# Altium schematic sheet MCU.SchDoc
size A4; SheetNumber: 2; SheetTotal: 5
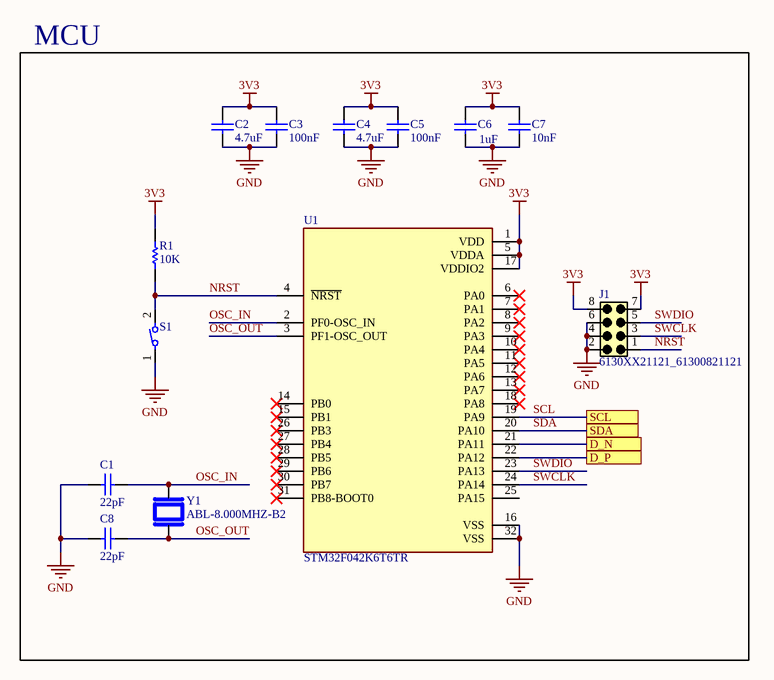
[diagram p0: MCU.SchDoc]

## Parts
C1  22pF  [CAP_0402L]
C2  4.7uF  [CAP_0402L]
C3  100nF  [CAP_0402L]
C4  4.7uF  [CAP_0402L]
C5  100nF  [CAP_0402L]
C6  1uF  [CAP_0402L]
C7  10nF  [CAP_0402L]
C8  22pF  [CAP_0402L]
J1  6130XX21121_61300821121  [61300821121]
R1  10K  [RES_0402N]
S1  434123025816  [434123025816]  (value not drawn)
U1  STM32F042K6T6TR  [QFP80P900X900X160-32N]
Y1  ABL-8.000MHZ-B2  [XTAL_HC49P488W46L1150T500H350]

## Blocks framed on the sheet
MCU: C1-C8 J1 R1 S1 U1 Y1

## Ports
D_N, D_P, SCL, SDA

## Nets
3V3: C2.2 C3.2 C4.2 C5.2 C6.2 C7.2 J1.7 J1.8 R1.2 U1.1(VDD) U1.5(VDDA) U1.17(VDDIO2)
GND: C1.1 C2.1 C3.1 C4.1 C5.1 C6.1 C7.1 C8.1 J1.2 J1.4 J1.6 S1.1 U1.16(VSS) U1.32(VSS)
D_N: U1.21(PA11) ; port D_N
D_P: U1.22(PA12) ; port D_P
NRST: J1.1 R1.1 S1.2 U1.4(~{NRST})
OSC_IN: C1.2 U1.2(PF0-OSC_IN) Y1.2
OSC_OUT: C8.2 U1.3(PF1-OSC_OUT) Y1.1
SCL: U1.19(PA9) ; port SCL
SDA: U1.20(PA10) ; port SDA
SWCLK: J1.3 U1.24(PA14)
SWDIO: J1.5 U1.23(PA13)

Not connected (* = marked no-connect by the designer): U1 6(PA0)* 7(PA1)* 8(PA2)* 9(PA3)* 10(PA4)* 11(PA5)* 12(PA6)* 13(PA7)* 14(PB0)* 15(PB1)* 18(PA8)* 25(PA15) 26(PB3)* 27(PB4)* 28(PB5)* 29(PB6)* 30(PB7)* 31(PB8-BOOT0)*

## Library data of the parts
C1 C8 = CAP CER 22pF: CAP CER 22pF 16V X7R 10% 0402; Value: 100nF; Capacitor Type: Ceramic; Mount: Surface Mount; RoHS: Yes; Tolerance: 10%; Case/Package: 0402; Construction: Flat; Width: 0.02inch; Voltage Rating: 16V; Packaging: Tape and Reel; Series: C; Thickness: 0.022inch; Voltage Rating (DC): 16V; Capacitance: 100nF; Dielectric Material: Ceramic; Package Quantity: 50000; Height: 0.5mm; Dielectric: X7R; Depth: 0.5mm; Length: 1mm; Max Operating Temperature: 125°C; Min Operating Temperature: -55°C
C2 C4 = CAP CER 4.7uF: CAP CER 4.7uF 16V X7R 10% 0402; Value: 100nF; Capacitor Type: Ceramic; Mount: Surface Mount; RoHS: Yes; Tolerance: 10%; Case/Package: 0402; Construction: Flat; Width: 0.02inch; Voltage Rating: 16V; Packaging: Tape and Reel; Series: C; Thickness: 0.022inch; Voltage Rating (DC): 16V; Capacitance: 100nF; Dielectric Material: Ceramic; Package Quantity: 50000; Height: 0.5mm; Dielectric: X7R; Depth: 0.5mm; Length: 1mm; Max Operating Temperature: 125°C; Min Operating Temperature: -55°C
C3 C5 C7 = CAP CER 100nF: CAP CER 100nF 16V X7R 10% 0402; Capacitor Type: Ceramic; Mount: Surface Mount; RoHS: Yes; Tolerance: 10%; Value: 100nF; Case/Package: 0402; Construction: Flat; Width: 0.02inch; Voltage Rating: 16V; Packaging: Tape and Reel; Series: C; Thickness: 0.022inch; Voltage Rating (DC): 16V; Capacitance: 100nF; Dielectric Material: Ceramic; Package Quantity: 50000; Height: 0.5mm; Dielectric: X7R; Depth: 0.5mm; Length: 1mm; Max Operating Temperature: 125°C; Min Operating Temperature: -55°C
C6 = CAP CER 100nF_1: CAP CER 100nF 16V X7R 10% 0402; Capacitor Type: Ceramic; Mount: Surface Mount; RoHS: Yes; Tolerance: 10%; Value: 100nF; Case/Package: 0402; Construction: Flat; Width: 0.02inch; Voltage Rating: 16V; Packaging: Tape and Reel; Series: C; Thickness: 0.022inch; Voltage Rating (DC): 16V; Capacitance: 100nF; Dielectric Material: Ceramic; Package Quantity: 50000; Height: 0.5mm; Dielectric: X7R; Depth: 0.5mm; Length: 1mm; Max Operating Temperature: 125°C; Min Operating Temperature: -55°C
J1 = 6130XX21121_61300821121: Connector Header Through Hole 8 position 0.100 (2.54mm); MF: Wurth Electronics; SnapEDA_Link: https://www.snapeda.com/parts/61300821121/Wurth+Electronics/view-part/?ref=snap; Package: None; Value: *; MP: 61300821121; Check_prices: https://www.snapeda.com/parts/61300821121/Wurth+Electronics/view-part/?ref=eda
R1 = RES SMD 10K: RES SMD 10K OHM 1% 1/16W 0402; Value: 0; Working Voltage: 50V; Temperature Coefficient: 100ppm/°C; Power Rating: 62.5mW; Resistance: 10kR; Lead Free: Lead Free; Height: 0.32mm; RoHS: Yes; Military Standard: Not; Lead Pitch: 0.2mm; Number of Terminations: 2; Case Code (Metric): 1005; REACH SVHC: No SVHC; Composition: Thick Film; Max Operating Temperature: 155°C; Tolerance: 1%; Min Operating Temperature: -55°C; Termination: SMD/SMT; Depth: 0.5mm; Width: 0.5mm; Voltage Rating: 50V; Number of Pins: 2; Length: 1mm; Case Code (Imperial): 0402; Case/Package: 0402; Mount: SMD; Packaging: Tape and Reel; Voltage Rating (DC): 50V
S1 = 434123025816: Tactile Switch SPST-NO Top Actuated Surface Mount; MF: WÃ¼rth Elektronik; SnapEDA_Link: https://www.snapeda.com/parts/434123025816/W%25C3%25BCrth+Elektronik+Midcom/view-part/?ref=snap; Package: None; Value: *; MP: 434123025816; Check_prices: https://www.snapeda.com/parts/434123025816/W%25C3%25BCrth+Elektronik+Midcom/view-part/?ref=eda
U1 = STM32F042K6T6TR: ARMÂ® CortexÂ®-M0 STM32F0 Microcontroller IC 32-Bit Single-Core 48MHz 32KB (32K x 8) FLASH 32-LQFP (7x7); MF: STMicroelectronics; SnapEDA_Link: https://www.snapeda.com/parts/STM32F042K6T6TR/STMicroelectronics/view-part/?ref=snap; Package: LQFP-32 STMicroelectronics; Value: *; MP: STM32F042K6T6TR; Check_prices: https://www.snapeda.com/parts/STM32F042K6T6TR/STMicroelectronics/view-part/?ref=eda
Y1 = ABL-8.000MHZ-B2: HC/49US (AT49) MICROPROCESSOR CRYSTAL; MF: Abracon; Check_prices: https://www.snapeda.com/parts/ABL-8.000MHZ-B2/Abracon+LLC/view-part/?ref=eda; Package: HC-49/US ABRACON; MP: ABL-8.000MHZ-B2; Value: *; SnapEDA_Link: https://www.snapeda.com/parts/ABL-8.000MHZ-B2/Abracon+LLC/view-part/?ref=snap; Availability: In Stock; Price: None; Purchase-URL: https://pricing.snapeda.com/search/part/ABL-8.000MHZ-B2/?ref=eda